# EAGLE schematic RILey-PCB_V2.0_v57 (EAGLE 9.7.0)
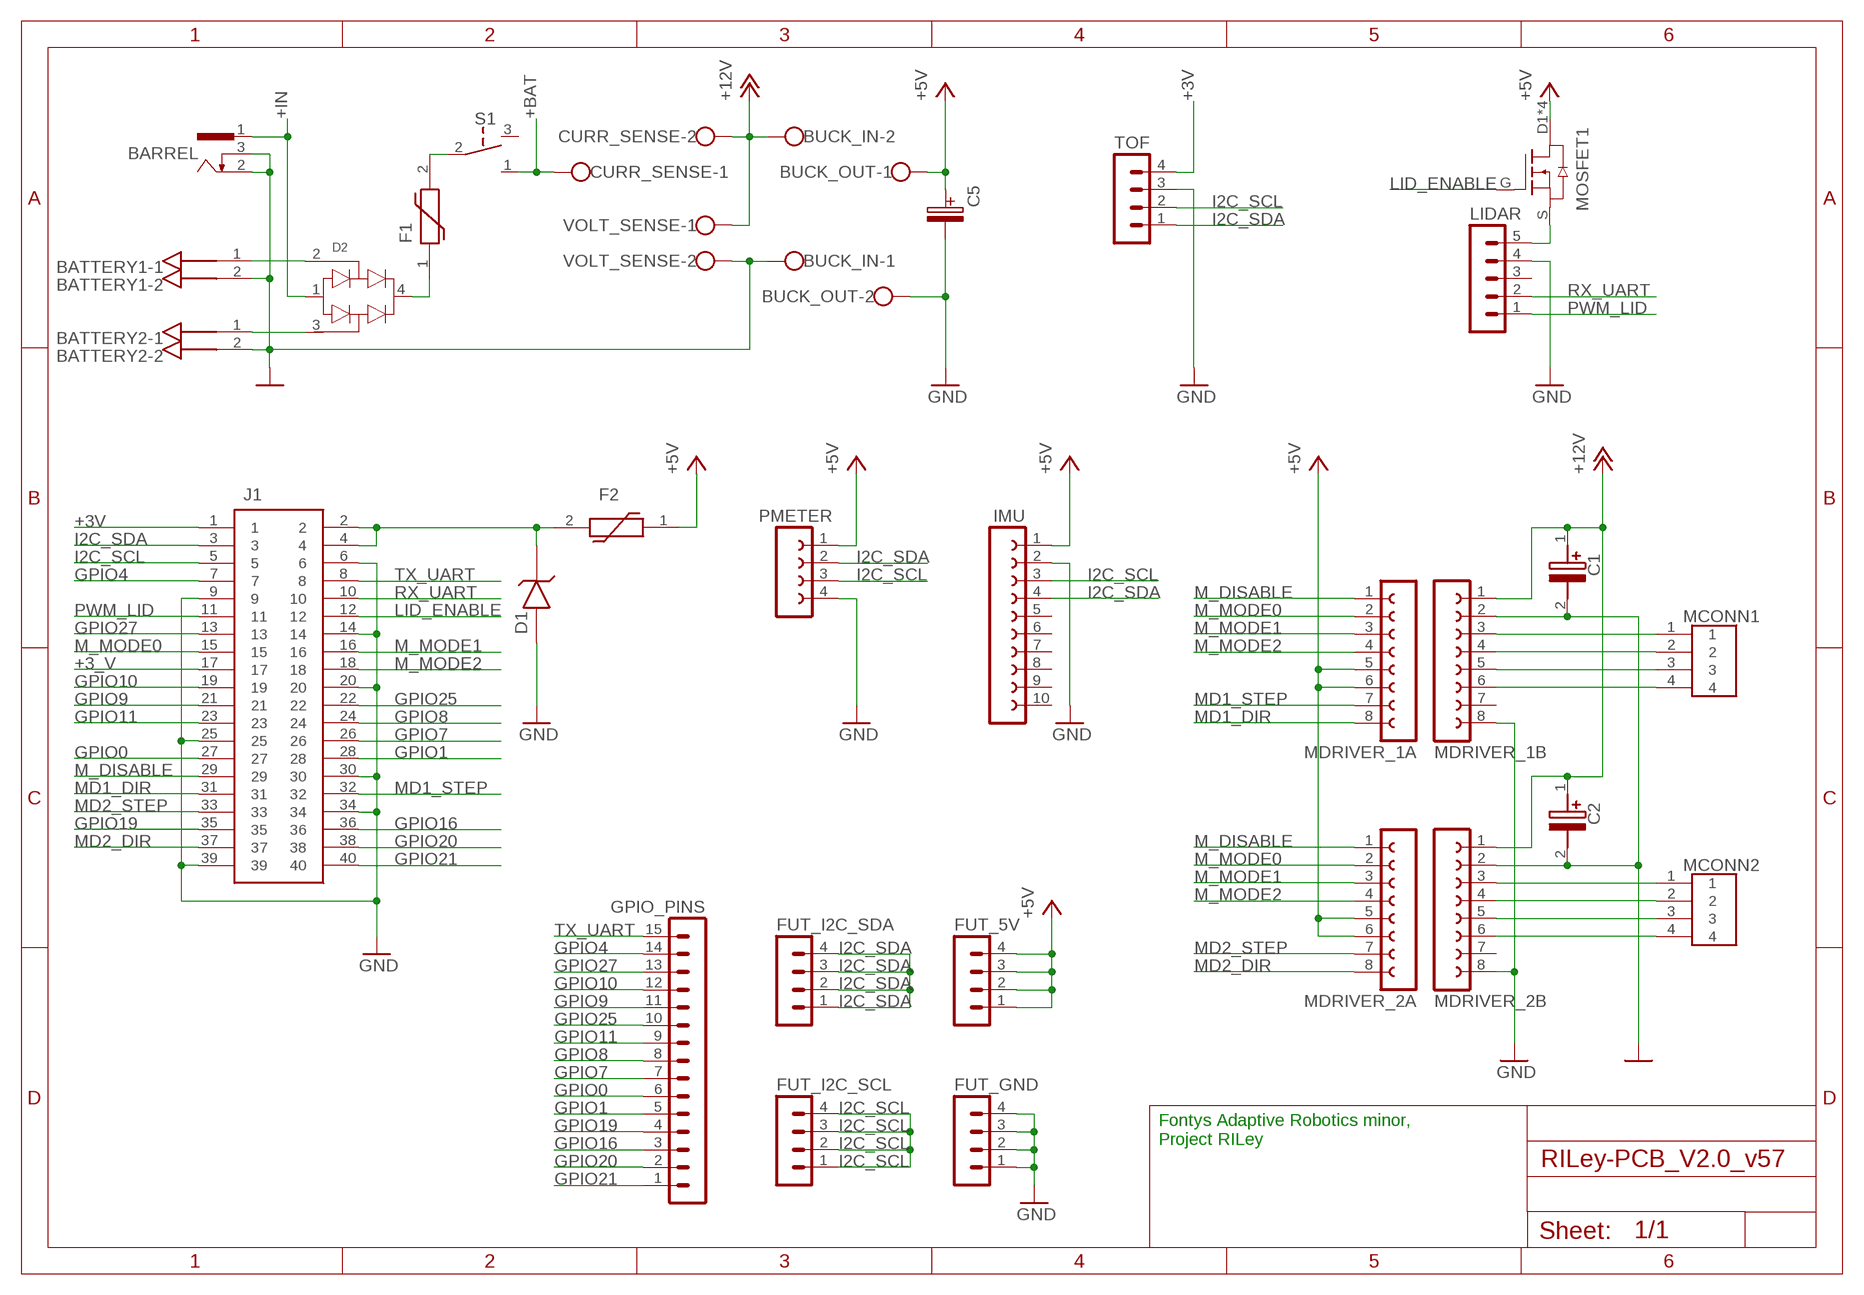
[diagram p0: schematic, sheet 1]

## Parts
BARREL  DC_BARREL0-62  [733980-62]
BATTERY1  0026604020  [KK41791-4020_2-PIN]
BATTERY2  0026604020  [KK41791-4020_2-PIN]
BUCK_IN  W237-102  [W237-102]
BUCK_OUT  W237-102  [W237-102]
C1  100uF  UPS1E101MED  [CAPPRD250W50D655H1250]
C2  100uF  UPS1E101MED  [CAPPRD250W50D655H1250]
C5  ELECTROLYTIC_CAPACITOR'8*20'  [ELECTROLYTIC_CAPACITOR]
CURR_SENSE  W237-102  [W237-102]
D1  ZENER-THDO-35  [ZENER-TH]
D2  DIODE-BRIGDE  [DIODE-BRIDGE]
F1  2920L400/15MR  [2920L400/15MR]
F2  1812L300MR  [1812L300MR]
FUT_5V  MA04-1_SMALLPAD  [MA04-1_S]
FUT_GND  MA04-1_SMALLPAD  [MA04-1_S]
FUT_I2C_SCL  MA04-1_SMALLPAD  [MA04-1_S]
FUT_I2C_SDA  MA04-1_SMALLPAD  [MA04-1_S]
GPIO_PINS  MA15-1W  [MA15-1W]
IMU  FE10-1_3D  [FE10-1]
J1  MC-254-40-00-ST-DIP  [MC-254-40-00-ST-DIP]
LIDAR  MA05-1_SMALLPAD  [MA05-1_S]
MCONN1  B4B-XH-A_LF__SN_  [B4B-XH-A_LF__SN_]
MCONN2  B4B-XH-A_LF__SN_  [B4B-XH-A_LF__SN_]
MDRIVER_1A  FE08-1_3D  [FE08-1]
MDRIVER_1B  FE08-1_3D  [FE08-1]
MDRIVER_2A  FE08-1_3D  [FE08-1]
MDRIVER_2B  FE08-1_3D  [FE08-1]
MOSFET1  SI2303CDS-T1-GE3  PMN30UNH  [TSOP6_SOT457]
PMETER  FE04-1  [FE04-1]
S1  1101M2S3CQE2  [1000-SERIES(SPDT)]
TOF  MA04-1W  [MA04-1W]
VOLT_SENSE  W237-102  [W237-102]

## Nets
0V [Power]: BARREL.2 BARREL.3 BATTERY1.2 BATTERY2.2 BUCK_IN.1 C1.2(-) C2.2(-) MDRIVER_1B.2 MDRIVER_2B.2 VOLT_SENSE.2
+3_V: J1.17
+3V: J1.1 TOF.4
+5V [Power]: BUCK_OUT.1 C5.+ F2.1 FUT_5V.1 FUT_5V.2 FUT_5V.3 FUT_5V.4 IMU.1 MDRIVER_1A.5 MDRIVER_1A.6 MDRIVER_2A.5 MDRIVER_2A.6 MOSFET1.D1(D) MOSFET1.D2(D) MOSFET1.D3(D) MOSFET1.D4(D) PMETER.1
+5V_FUSED [Power]: D1.C F2.2 J1.2 J1.4
+12V [Power]: BUCK_IN.2 C1.1(+) C2.1(+) CURR_SENSE.2 MDRIVER_1B.1 MDRIVER_2B.1 VOLT_SENSE.1
+BAT [Power]: CURR_SENSE.1 S1.1
+BAT1 [Power]: BATTERY1.1 D2.2
+BAT2 [Power]: BATTERY2.1 D2.3
+IN [Power]: BARREL.1 D2.1
GND [Power]: BUCK_OUT.2 C5.- D1.A FUT_GND.1 FUT_GND.2 FUT_GND.3 FUT_GND.4 IMU.2 J1.6 J1.9 J1.14 J1.20 J1.25 J1.30 J1.34 J1.39 LIDAR.4 MDRIVER_1B.8 MDRIVER_2B.8 PMETER.4 TOF.3
GPIO0: GPIO_PINS.6 J1.27
GPIO1: GPIO_PINS.5 J1.28
GPIO4: GPIO_PINS.14 J1.7
GPIO7: GPIO_PINS.7 J1.26
GPIO8: GPIO_PINS.8 J1.24
GPIO9: GPIO_PINS.11 J1.21
GPIO10: GPIO_PINS.12 J1.19
GPIO11: GPIO_PINS.9 J1.23
GPIO16: GPIO_PINS.3 J1.36
GPIO19: GPIO_PINS.4 J1.35
GPIO20: GPIO_PINS.2 J1.38
GPIO21: GPIO_PINS.1 J1.40
GPIO25: GPIO_PINS.10 J1.22
GPIO27: GPIO_PINS.13 J1.13
I2C_SCL: FUT_I2C_SCL.1 FUT_I2C_SCL.2 FUT_I2C_SCL.3 FUT_I2C_SCL.4 IMU.3 J1.5 PMETER.3 TOF.2
I2C_SDA: FUT_I2C_SDA.1 FUT_I2C_SDA.2 FUT_I2C_SDA.3 FUT_I2C_SDA.4 IMU.4 J1.3 PMETER.2 TOF.1
IN [Heavy duty]: D2.4 F1.1
LID_ENABLE: J1.12 MOSFET1.G
M_DISABLE: J1.29 MDRIVER_1A.1 MDRIVER_2A.1
M_MODE0: J1.15 MDRIVER_1A.2 MDRIVER_2A.2
M_MODE1: J1.16 MDRIVER_1A.3 MDRIVER_2A.3
M_MODE2: J1.18 MDRIVER_1A.4 MDRIVER_2A.4
MD1_DIR: J1.31 MDRIVER_1A.8
MD1_STEP: J1.32 MDRIVER_1A.7
MD2_DIR: J1.37 MDRIVER_2A.8
MD2_STEP: J1.33 MDRIVER_2A.7
N$1: LIDAR.5 MOSFET1.S
N$3 [Power]: F1.2 S1.2
N$4 [Power]: MCONN1.1 MDRIVER_1B.3
N$5 [Power]: MCONN1.2 MDRIVER_1B.4
N$6 [Power]: MCONN1.3 MDRIVER_1B.5
N$7 [Power]: MCONN1.4 MDRIVER_1B.6
N$8 [Power]: MCONN2.1 MDRIVER_2B.3
N$9 [Power]: MCONN2.2 MDRIVER_2B.4
N$10 [Power]: MCONN2.3 MDRIVER_2B.5
N$11 [Power]: MCONN2.4 MDRIVER_2B.6
PWM_LID: J1.11 LIDAR.1
RX_UART: J1.10 LIDAR.2
TX_UART: GPIO_PINS.15 J1.8
Unconnected: IMU.5 IMU.6 IMU.7 IMU.8 IMU.9 IMU.10 LIDAR.3 MDRIVER_1B.7 MDRIVER_2B.7 S1.3

## Notes on the sheet
- Fontys Adaptive Robotics minor,
  Project RILey

## Library data of the parts
BARREL = Custom parts:DC_BARREL: FEMALE PRINT CONNECTOR Niedervolt-Steckverbinder Distributor Conrad
BATTERY1 BATTERY2 = Molex:0026604020: KK® 396 Header, Vertical, Friction Lock, 2 Circuits, Tin (Sn) Plating KK® Interconnect System Documentation Drawing <http://www.molex.com/pdm_docs/sd/026604020_sd.pdf>; CATEGORY: Connectors, Interconnects; COLOR: Natural; CONNECTOR_TYPE: Header, Unshrouded; CONTACT_FINISH: Tin; CONTACT_FINISH_THICKNESS: 60µin (1.52µm); CONTACT_MATING_LENGTH: 0.450" (11.43mm); CONTACT_TYPE: Male Pin; DESCRIPTION: CONN HEADER 2POS .156 VERT TIN; DOCUMENTATION_LINK: <a href="http://www.molex.com/pdm_docs/sd/026604020_sd.pdf">Datasheet</a>; DOCUMENTATION_URL: http://www.molex.com/pdm_docs/sd/026604020_sd.pdf; FAMILY: Rectangular Connectors - Headers, Male Pins; FASTENING_TYPE: Friction Lock; FEATURES: -; MANUFACTURER: Molex Inc; MOUNTING_TYPE: Through Hole; NUMBER_OF_POSITIONS: 2; NUMBER_OF_POSITIONS_LOADED: All; NUMBER_OF_ROWS: 1; PART_NUMBER: 0026604020; PITCH: 0.156" (3.96mm); ROW_SPACING: -; SERIES: KK® 41791; SUPPLIER_ITEM_LINK: <a href="http://www.digikey.com/product-search/en?KeyWords=0026604020&WT.z_header=search_go">Details</a>; SUPPLIER_ITEM_NUMBER: WM4620-ND; SUPPLIER_ITEM_URL: http://www.digikey.com/product-search/en?KeyWords=0026604020&WT.z_header=search_go; SUPPLIER_LINK: <a href="http://www.digikey.com">Home Page</a>; SUPPLIER_NAME: Digi-Key; SUPPLIER_URL: http://www.digikey.com; TERMINATION: Solder
BUCK_IN BUCK_OUT CURR_SENSE VOLT_SENSE = con-wago-500:W237-102: WAGO SCREW CLAMP; MPN: 237-102; OC_FARNELL: unknown; OC_NEWARK: 70K9898
C1 C2 = Capacitors:UPS1E101MED: Al electrolytic cap,PS,25V,100 F Nichicon 100uF 25 V dc Aluminium Electrolytic Capacitor, PS Series 2000h 6.3 (Dia.) x 11mm Source: Datasheet <http://uk.rs-online.com/web/p/products/5194059P>; ALLIED_NUMBER: 70187653; DESCRIPTION: Al electrolytic cap,PS,25V,100 F Nichicon 100uF 25 V dc Aluminium Electrolytic Capacitor, PS Series 2000h 6.3 (Dia.) x 11mm; HEIGHT: 12.5mm; MANUFACTURER_NAME: Nichicon; MANUFACTURER_PART_NUMBER: UPS1E101MED; RS_PART_NUMBER: 5194059P; RS_PRICE-STOCK: http://uk.rs-online.com/web/p/products/5194059P
C5 = Capacitors:ELECTROLYTIC_CAPACITOR
D1 = Diodes:ZENER-TH
D2 = Custom parts:DIODE-BRIGDE
F1 = Fuses:2920L400/15MR
F2 = Fuses:1812L300MR
FUT_5V FUT_GND FUT_I2C_SCL FUT_I2C_SDA = Male_Headers:MA04-1: PIN HEADER
GPIO_PINS = Male-Pinheaders:MA15-1W: PIN HEADER
IMU = Female_Headers:FE10-1: FEMALE HEADER
J1 = Custom parts:MC-254-40-00-ST-DIP: CONNECTOR, HEADER, 40POS, 2ROW, 2.54MM; Pitch Spacing:2.54mm; No. of Contacts:40Contacts; Gender:Header; Product Range:-; Contact Termination Type:Through Hole; No. of Rows:2Rows; Contact Plating:Gold Plated Contacts RoHS Compliant: Yes Source: Datasheet <https://componentsearchengine.com/Datasheets/2/MC-254-40-00-ST-DIP.pdf>; DESCRIPTION: CONNECTOR, HEADER, 40POS, 2ROW, 2.54MM; Pitch Spacing:2.54mm; No. of Contacts:40Contacts; Gender:Header; Product Range:-; Contact Termination Type:Through Hole; No. of Rows:2Rows; Contact Plating:Gold Plated Contacts RoHS Compliant: Yes; HEIGHT: 9.1mm; MANUFACTURER_NAME: MULTICOMP; MANUFACTURER_PART_NUMBER: MC-254-40-00-ST-DIP
LIDAR = Male_Headers:MA05-1: PIN HEADER
MCONN1 MCONN2 = Custom parts:B4B-XH-A_LF__SN_: XH-2.5mm Header top entry 4 way JST XH Series, Series Number B4B, 2.5mm Pitch 4 Way 1 Row Straight PCB Header, Solder Termination, 3A Source: Datasheet; DESCRIPTION: XH-2.5mm Header top entry 4 way JST XH Series, Series Number B4B, 2.5mm Pitch 4 Way 1 Row Straight PCB Header, Solder Termination, 3A; HEIGHT: 7mm; MANUFACTURER_NAME: JST (JAPAN SOLDERLESS TERMINALS); MANUFACTURER_PART_NUMBER: B4B-XH-A(LF)(SN)
MDRIVER_1A MDRIVER_1B MDRIVER_2A MDRIVER_2B = Female_Headers:FE08-1: FEMALE HEADER
MOSFET1 = Custom parts:PMN30UNH
PMETER = Female_Headers:FE04-1: FEMALE HEADER
S1 = SamacSys_Parts:1101M2S3CQE2: 1101M2S3CQE2 (Slide Switches) Source: Datasheet <http://uk.rs-online.com/web/p/products/1617340>; ALLIED_NUMBER: 70128282; DESCRIPTION: 1101M2S3CQE2 (Slide Switches); HEIGHT: mm; MANUFACTURER_NAME: C & K COMPONENTS; MANUFACTURER_PART_NUMBER: 1101M2S3CQE2; RS_PART_NUMBER: 1617340; RS_PRICE-STOCK: http://uk.rs-online.com/web/p/products/1617340
TOF = Male-Pinheaders:MA04-1W: PIN HEADER

## Net classes
1 Power: width 0.635 mm, clearance 0.381 mm
2 Heavy duty: width 1.524 mm, clearance 0.381 mm